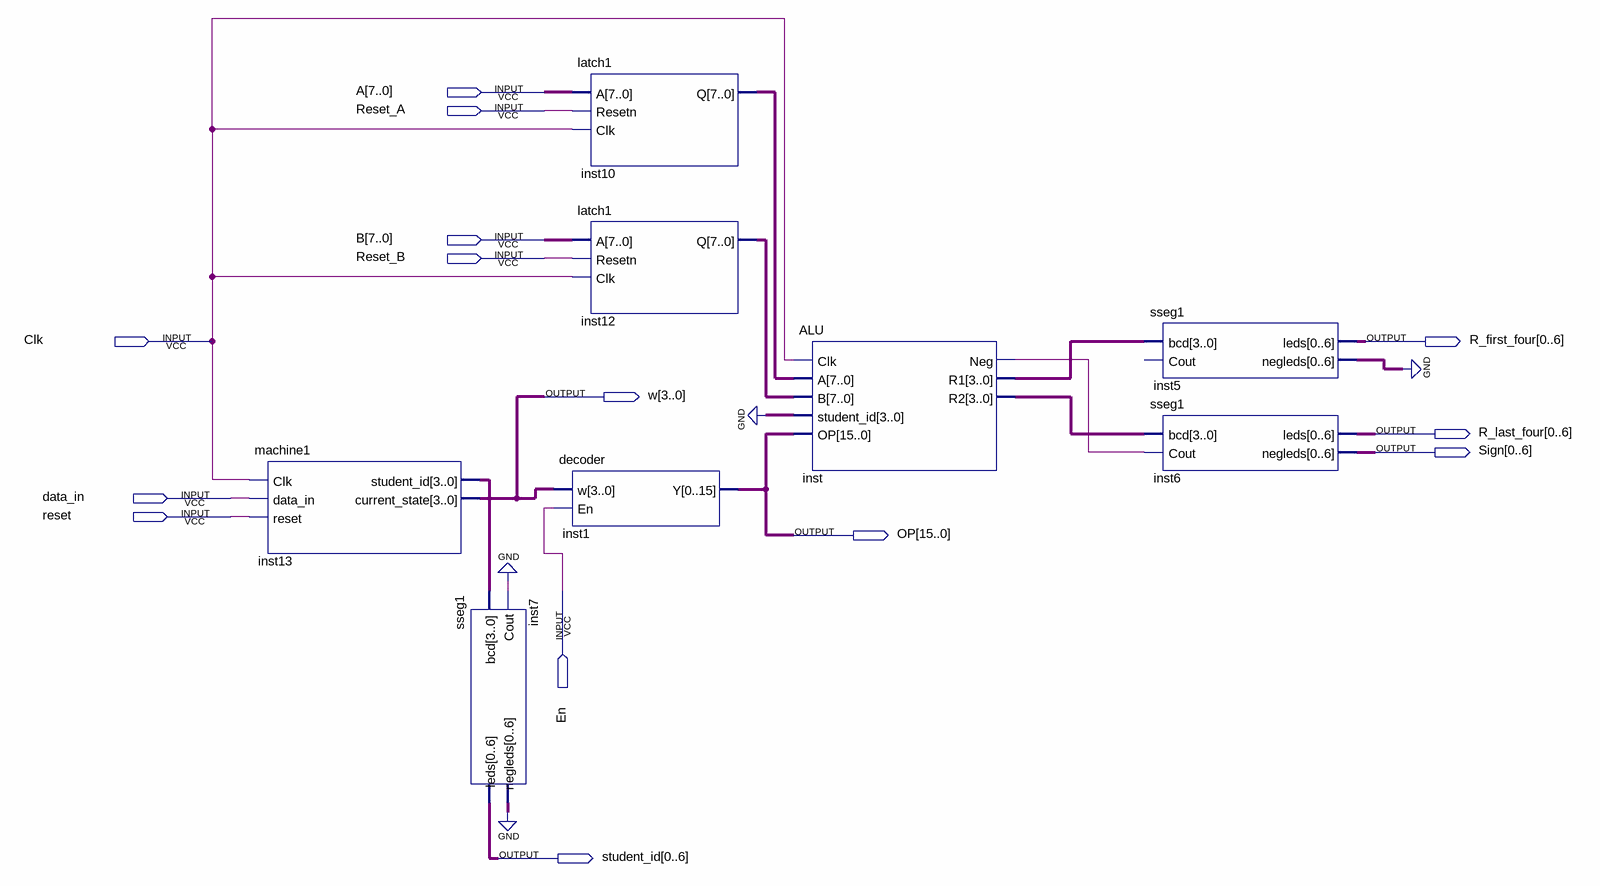
[diagram p0: schematic sheet]
// Quartus schematic ALU1.bdf as structural Verilog: 8 symbols, 14 pins
module ALU1 (
  input  [7:0] A,
  input  Reset_A,
  input  [7:0] B,
  input  Reset_B,
  input  Clk,
  input  data_in,
  input  reset,
  input  En,
  output [0:6] R_first_four,
  output [3:0] w,
  output [0:6] R_last_four,
  output [0:6] Sign,
  output [15:0] OP,
  output [0:6] student_id
);

  wire inst_neg;
  wire [3:0] inst13_student_id, inst_r1, inst_r2;
  wire [6:0] inst5_negleds, inst7_negleds;
  wire [7:0] inst10_q, inst12_q;

  machine1 inst13 (.Clk(Clk), .data_in(data_in), .reset(reset), .student_id(inst13_student_id), .current_state(w));
  sseg1 inst7 (.bcd(inst13_student_id), .Cout(1'b0), .leds(student_id), .negleds(inst7_negleds));
  latch1 inst10 (.A(A), .Resetn(Reset_A), .Clk(Clk), .Q(inst10_q));
  latch1 inst12 (.A(B), .Resetn(Reset_B), .Clk(Clk), .Q(inst12_q));
  decoder inst1 (.w(w), .En(En), .Y(OP));
  ALU inst (
    .Clk(Clk), .A(inst10_q), .B(inst12_q), .student_id(4'b0000), .OP(OP), .Neg(inst_neg), .R1(inst_r1),
    .R2(inst_r2));
  sseg1 inst5 (.bcd(inst_r1), .leds(R_first_four), .negleds(inst5_negleds));  // open: Cout
  sseg1 inst6 (.bcd(inst_r2), .Cout(inst_neg), .leds(R_last_four), .negleds(Sign));
  // also tied to GND on the sheet: {inst5_negleds[0], inst5_negleds[1], inst5_negleds[2], inst5_negleds[3], inst5_negleds[4], inst5_negleds[5], inst5_negleds[6], inst7_negleds[0], inst7_negleds[1], inst7_negleds[2], inst7_negleds[3], inst7_negleds[4], inst7_negleds[5], inst7_negleds[6]}
endmodule
